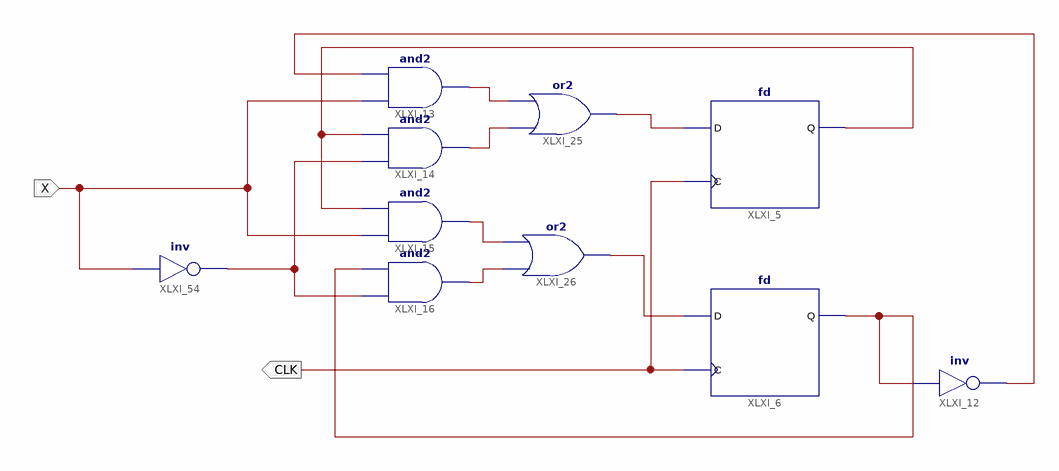
[diagram p0: schematic sheet 1]
// Xilinx ISE schematic C4_13.sch (kintex7) as structural Verilog: 10 symbols, 2 ports
module C4_13 (
  input  X,
  output CLK
);

  wire XLXN_10, XLXN_11, XLXN_12, XLXN_13, XLXN_14, XLXN_15, XLXN_16, XLXN_17, XLXN_19, XLXN_108;

  or XLXI_26 (XLXN_15, XLXN_13, XLXN_12);
  or XLXI_25 (XLXN_14, XLXN_11, XLXN_10);
  and XLXI_16 (XLXN_13, XLXN_108, XLXN_19);
  and XLXI_15 (XLXN_12, X, XLXN_17);
  and XLXI_14 (XLXN_11, XLXN_108, XLXN_17);
  and XLXI_13 (XLXN_10, X, XLXN_16);
  not XLXI_12 (XLXN_16, XLXN_19);
  fd XLXI_6 (.C(CLK), .D(XLXN_15), .Q(XLXN_19));
  fd XLXI_5 (.C(CLK), .D(XLXN_14), .Q(XLXN_17));
  not XLXI_54 (XLXN_108, X);
endmodule
